# Altium schematic sheet Main.SchDoc
size A
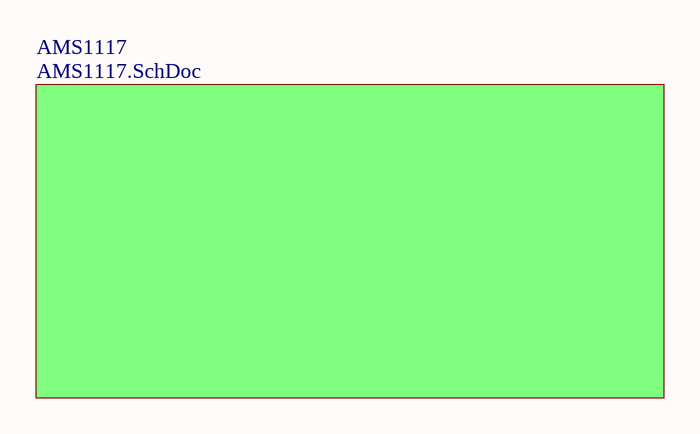
[diagram p0: Main.SchDoc]

## Sub-sheets
AMS1117 = AMS1117.SchDoc: no entries